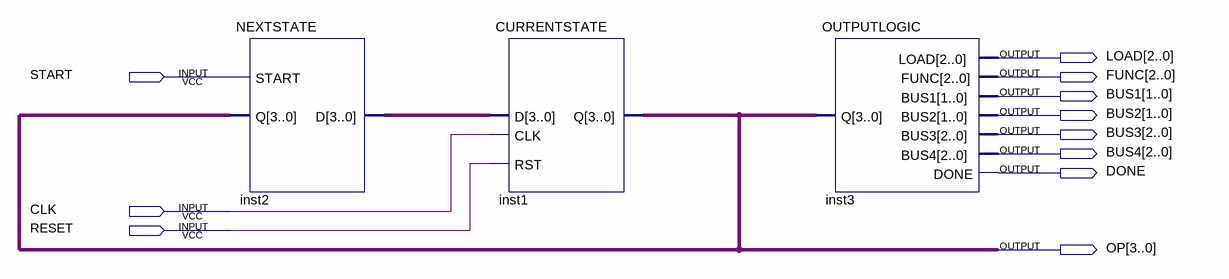
[diagram p0: schematic sheet]
// Quartus schematic Control.bdf as structural Verilog: 3 symbols, 11 pins
module Control (
  input  START,
  input  CLK,
  input  RESET,
  output [2:0] LOAD,
  output [2:0] FUNC,
  output [1:0] BUS1,
  output [1:0] BUS2,
  output [2:0] BUS3,
  output [2:0] BUS4,
  output DONE,
  output [3:0] OP
);

  wire [3:0] inst2_d;

  NEXTSTATE inst2 (.START(START), .Q(OP), .D(inst2_d));
  CURRENTSTATE inst1 (.D(inst2_d), .CLK(CLK), .RST(RESET), .Q(OP));
  OUTPUTLOGIC inst3 (.Q(OP), .LOAD(LOAD), .FUNC(FUNC), .BUS1(BUS1), .BUS2(BUS2), .BUS3(BUS3), .BUS4(BUS4), .DONE(DONE));
endmodule
